# Altium schematic sheet thu RF.SchDoc
size A
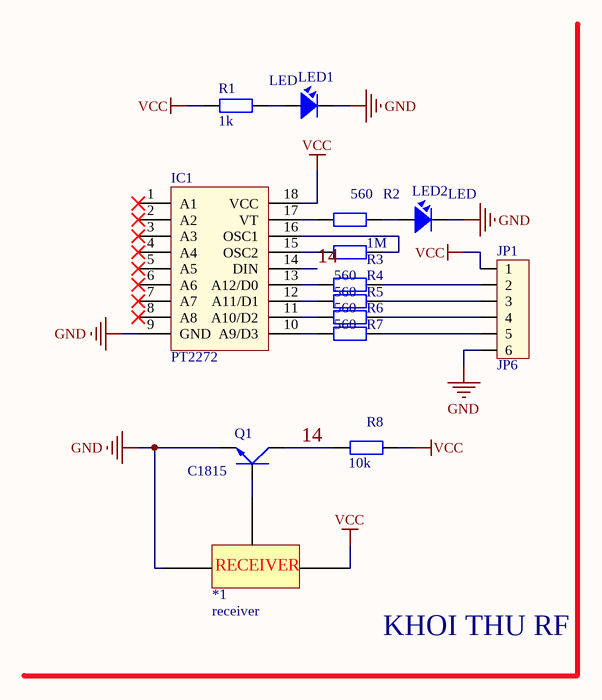
[diagram p0: thu RF.SchDoc]

## Parts
*1  receiver
IC1  PT2272  [DIP18/W0.3]
JP1  JP6  [CON6]
LED1  LED  [LED-3]
LED2  LED  [LED-3]
Q1  C1815  [QTO-92]
R1  1k  [R1/4W]
R2  560  [R1/4W]
R3  1M  [R1/4W]
R4  560  [R1/4W]
R5  560  [R1/4W]
R6  560  [R1/4W]
R7  560  [R1/4W]
R8  10k  [R1/4W]

## Nets
GND: *1.?1 IC1.9(GND) JP1.6 LED1.2 LED2.2 Q1.1(E)
VCC: *1.?2 IC1.18(VCC) JP1.1 R1.1 R8.2
14: IC1.14(DIN) Q1.2(C) R8.1
Net*1_?3: *1.?3 Q1.3(B)
NetIC1_10: IC1.10(A9/D3) R7.1
NetIC1_11: IC1.11(A10/D2) R6.1
NetIC1_12: IC1.12(A11/D1) R5.1
NetIC1_13: IC1.13(A12/D0) R4.1
NetIC1_15: IC1.15(OSC2) R3.2
NetIC1_16: IC1.16(OSC1) R3.1
NetIC1_17: IC1.17(VT) R2.1
NetJP1_2: JP1.2 R4.2
NetJP1_3: JP1.3 R5.2
NetJP1_4: JP1.4 R6.2
NetJP1_5: JP1.5 R7.2
NetLED1_1: LED1.1 R1.2
NetLED2_1: LED2.1 R2.2

Not connected (* = marked no-connect by the designer): IC1 1(A1)* 2(A2)* 3(A3)* 4(A4)* 5(A5)* 6(A6)* 7(A7)* 8(A8)*

## Notes on the sheet
- KHOI THU RF
- (in symbol receiver) RECEIVER

## Library data of the parts
IC1 = PT2272: Remote Control Decoder
JP1 = Con6: Connector 6; Value: Connector 6
LED1 LED2 = LED: LED Single colour Green and Red; Value: LED 3 ly Single Colour; Description: LED 5 ly Single Colour; Description: Led  Vuong
Q1 = C1815: NPN 600mW, ECB; Value: C1815
R1-R8 = R1/4W: Resistor 1/4W; Value: R1/4W - 1K